# Altium schematic sheet rtm-connectors.SchDoc: MicroTCA RTM Connectors
size A3; DocumentNumber: 2; SheetNumber: 2; SheetTotal: 9
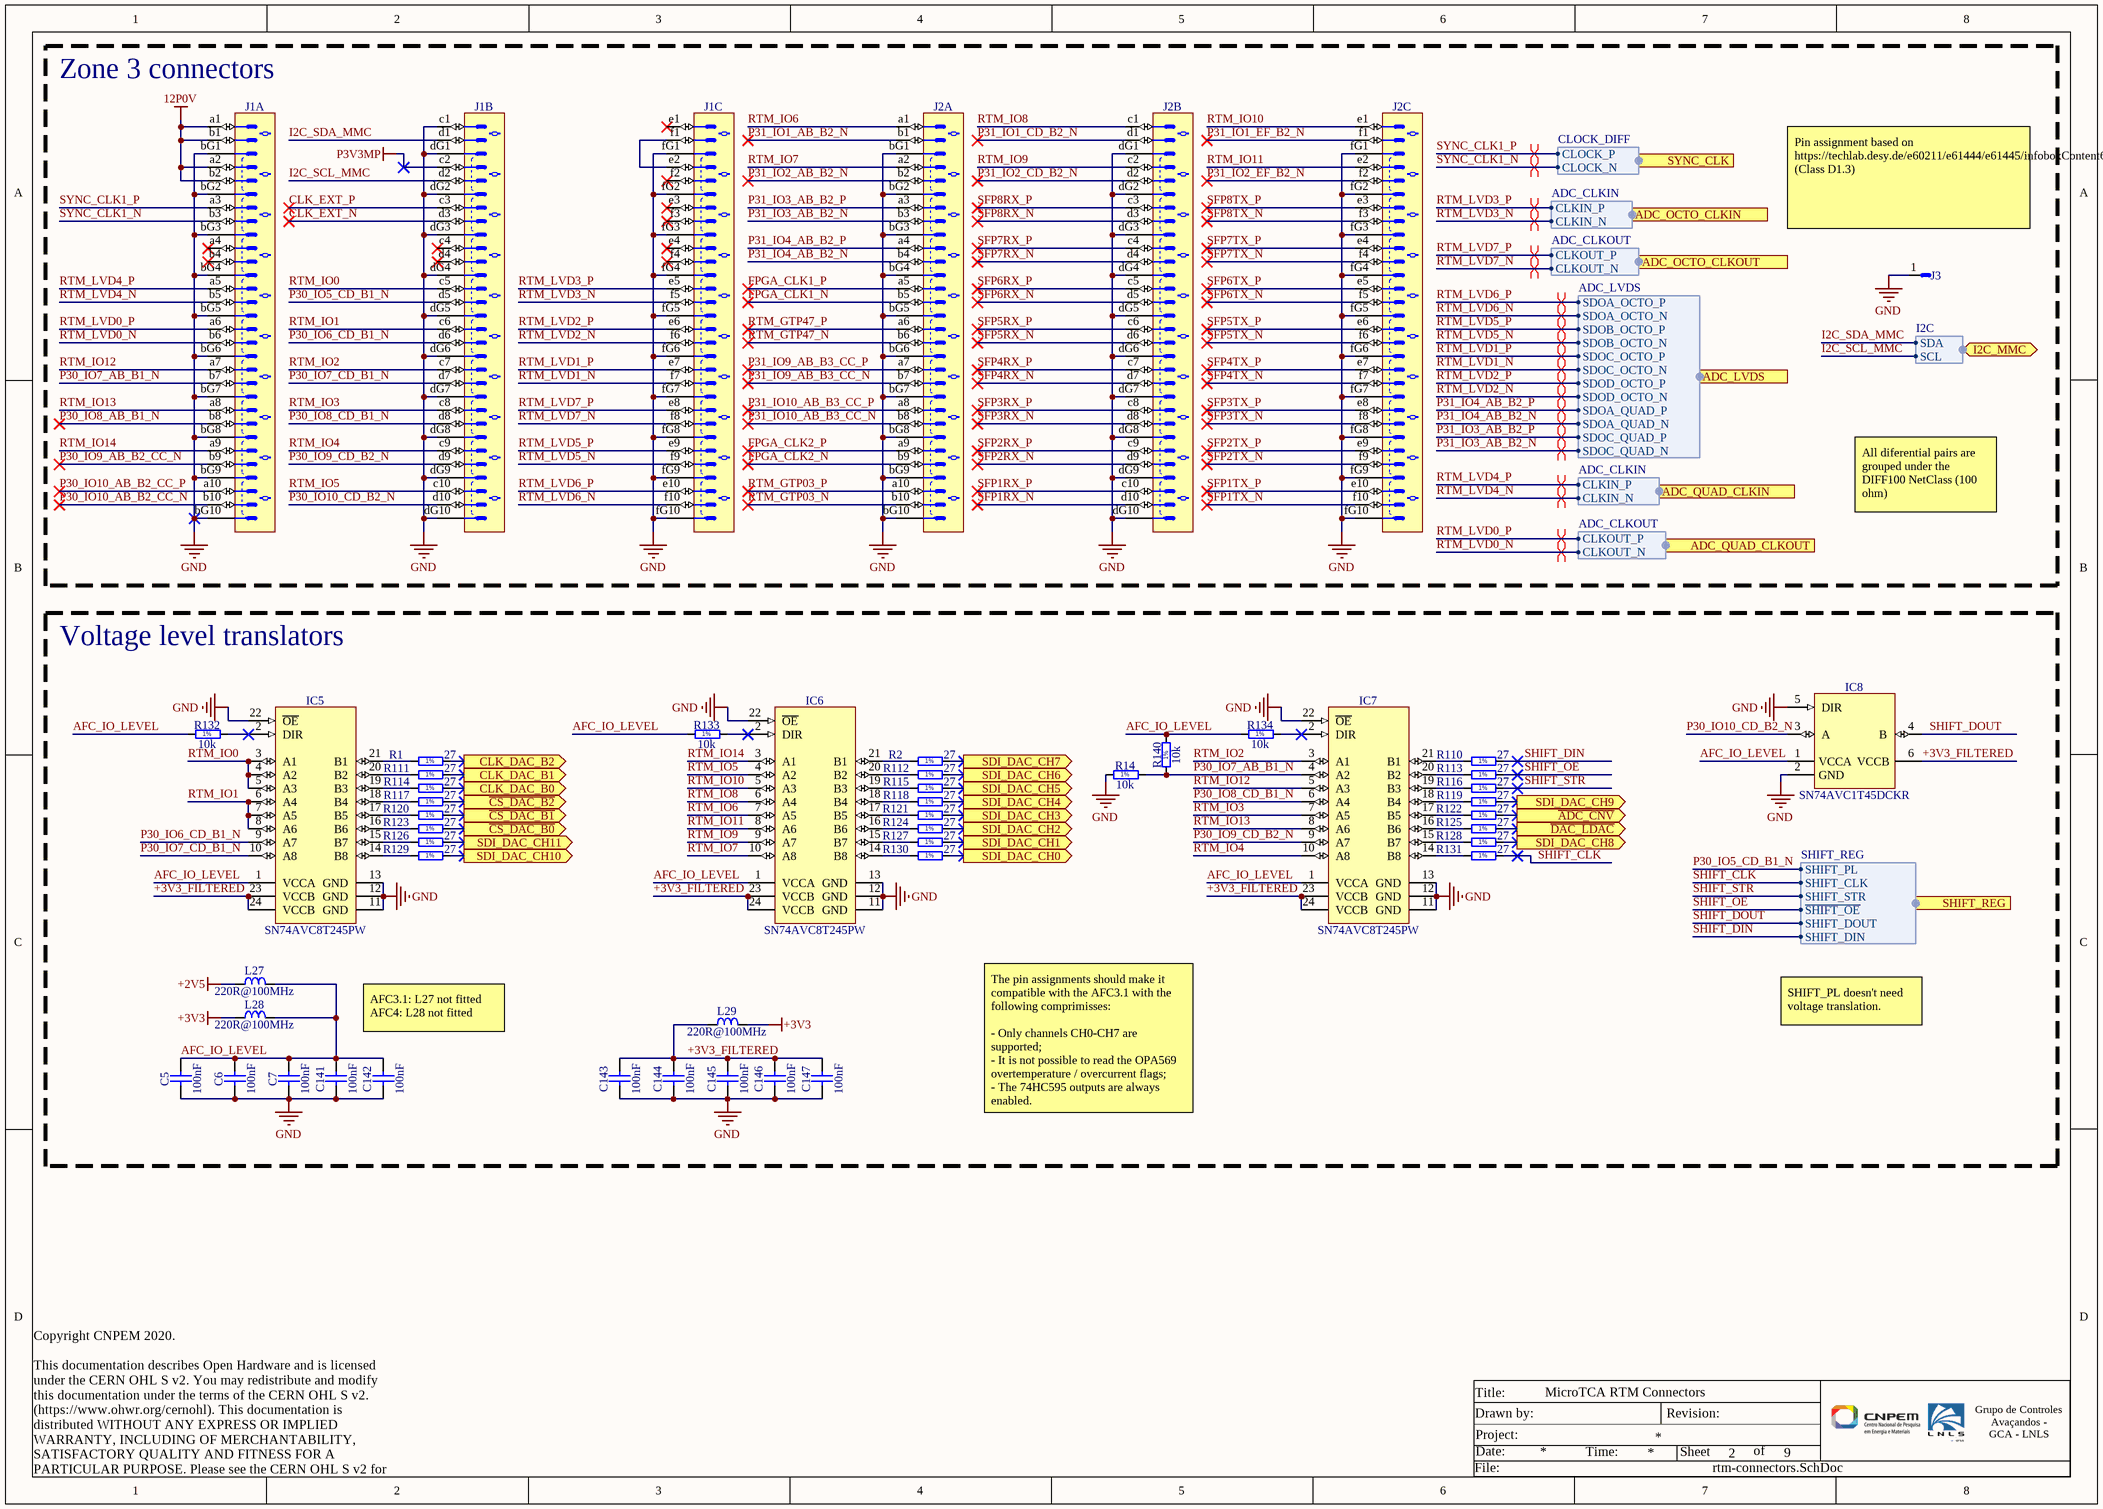
[diagram p0: rtm-connectors.SchDoc]

## Parts
C5  100nF  [CAPC1005X55N]
C6  100nF  [CAPC1005X55N]
C7  100nF  [CAPC1005X55N]
C141  100nF  [CAPC1005X55N]
C142  100nF  [CAPC1005X55N]
C143  100nF  [CAPC1005X55N]
C144  100nF  [CAPC1005X55N]
C145  100nF  [CAPC1005X55N]
C146  100nF  [CAPC1005X55N]
C147  100nF  [CAPC1005X55N]
IC5  SN74AVC8T245PW  [SOP65P640X120-24N]
IC6  SN74AVC8T245PW  [SOP65P640X120-24N]
IC7  SN74AVC8T245PW  [SOP65P640X120-24N]
IC8  SN74AVC1T45DCKR  [SOT65P210X110-6N]
J1  Advanced TCA  [TYCO_6469183-1_0.65mm]  (value not drawn)  (parts A,B,C of 3)
J2  Advanced TCA  [TYCO_6469183-1_0.65mm]  (value not drawn)  (parts A,B,C of 3)
J3  (no value)  [TYCO_1469265-1]
L27  220R@100MHz  [INDC2012X105N]
L28  220R@100MHz  [INDC2012X105N]
L29  220R@100MHz  [INDC2012X105N]
R1  27  [RESC1005X40N]
R2  27  [RESC1005X40N]
R14  10k  [RESC1005X40N]
R110  27  [RESC1005X40N]
R111  27  [RESC1005X40N]
R112  27  [RESC1005X40N]
R113  27  [RESC1005X40N]
R114  27  [RESC1005X40N]
R115  27  [RESC1005X40N]
R116  27  [RESC1005X40N]
R117  27  [RESC1005X40N]
R118  27  [RESC1005X40N]
R119  27  [RESC1005X40N]
R120  27  [RESC1005X40N]
R121  27  [RESC1005X40N]
R122  27  [RESC1005X40N]
R123  27  [RESC1005X40N]
R124  27  [RESC1005X40N]
R125  27  [RESC1005X40N]
R126  27  [RESC1005X40N]
R127  27  [RESC1005X40N]
R128  27  [RESC1005X40N]
R129  27  [RESC1005X40N]
R130  27  [RESC1005X40N]
R131  27  [RESC1005X40N]
R132  10k  [RESC1005X40N]
R133  10k  [RESC1005X40N]
R134  10k  [RESC1005X40N]
R140  10k  [RESC1005X40N]

## Blocks framed on the sheet
Zone 3 connectors: J1-J3
Voltage level translators: C5-C7 C141-C147 IC5-IC8 L27-L29 R1 R2 R14 R110-R134 R140

## Ports
ADC_LVDS (harness ADC_LVDS), ADC_OCTO_CLKIN (harness ADC_CLKIN), ADC_OCTO_CLKOUT (harness ADC_CLKOUT), ADC_QUAD_CLKIN (harness ADC_CLKIN), ADC_QUAD_CLKOUT (harness ADC_CLKOUT), CLK_DAC_B0 (out), CLK_DAC_B1 (out), CLK_DAC_B2 (out), I2C_MMC (bidir, harness I2C), SDI_DAC_CH0 (out), SDI_DAC_CH1 (out), SDI_DAC_CH2 (out), SDI_DAC_CH3 (out), SDI_DAC_CH4 (out), SDI_DAC_CH5 (out), SDI_DAC_CH6 (out), SDI_DAC_CH7 (out), SDI_DAC_CH8 (out), SDI_DAC_CH9 (out), SDI_DAC_CH10 (out), SDI_DAC_CH11 (out), SHIFT_REG (out, harness SHIFT_REG), SYNC_CLK (harness CLOCK_DIFF), ~{ADC_CNV} (out), ~{CS_DAC_B0} (out), ~{CS_DAC_B1} (out), ~{CS_DAC_B2} (out), ~{DAC_LDAC} (out)

## Harnesses
CLOCK_DIFF: CLOCK_P, CLOCK_N
I2C: SDA, SCL
SHIFT_REG: SHIFT_PL, SHIFT_CLK, SHIFT_STR, ~{SHIFT_OE}, SHIFT_DOUT, SHIFT_DIN
ADC_LVDS: SDOA_OCTO_P, SDOA_OCTO_N, SDOB_OCTO_P, SDOB_OCTO_N, SDOC_OCTO_P, SDOC_OCTO_N, SDOD_OCTO_P, SDOD_OCTO_N, SDOA_QUAD_P, SDOA_QUAD_N, SDOC_QUAD_P, SDOC_QUAD_N
ADC_CLKIN: CLKIN_P, CLKIN_N
ADC_CLKOUT: CLKOUT_P, CLKOUT_N

## Nets
12P0V: J1.a1 J1.a2 J1.b1 J1.b2
+2V5: L27.1
+3V3: L28.1 L29.2
GND: C5.1 C6.1 C7.1 C141.1 C142.1 C143.1 C144.1 C145.1 C146.1 C147.1 IC5.11(GND) IC5.12(GND) IC5.13(GND) IC5.22(~{OE}) IC6.11(GND) IC6.12(GND) IC6.13(GND) IC6.22(~{OE}) IC7.11(GND) IC7.12(GND) IC7.13(GND) IC7.22(~{OE}) IC8.2(GND) IC8.5(DIR) J1.bG1 J1.bG2 J1.bG3 J1.bG4 J1.bG5 J1.bG6 J1.bG7 J1.bG8 J1.bG9 J1.bG10 J1.c1 J1.dG1 J1.dG2 J1.dG3 J1.dG4 J1.dG5 J1.dG6 J1.dG7 J1.dG8 J1.dG9 J1.dG10 J1.fG1 J1.fG2 J1.fG3 J1.fG4 J1.fG5 J1.fG6 J1.fG7 J1.fG8 J1.fG9 J1.fG10 J2.bG1 J2.bG2 J2.bG3 J2.bG4 J2.bG5 J2.bG6 J2.bG7 J2.bG8 J2.bG9 J2.bG10 J2.dG1 J2.dG2 J2.dG3 J2.dG4 J2.dG5 J2.dG6 J2.dG7 J2.dG8 J2.dG9 J2.dG10 J2.fG1 J2.fG2 J2.fG3 J2.fG4 J2.fG5 J2.fG6 J2.fG7 J2.fG8 J2.fG9 J2.fG10 J3.1 R14.1
P3V3MP: J1.c2
+3V3_FILTERED: C143.2 C144.2 C145.2 C146.2 C147.2 IC5.23(VCCB) IC5.24(VCCB) IC6.23(VCCB) IC6.24(VCCB) IC7.23(VCCB) IC7.24(VCCB) IC8.6(VCCB) L29.1
~{ADC_CNV}: R122.2 ; port ~{ADC_CNV}
AFC_IO_LEVEL: C5.2 C6.2 C7.2 C141.2 C142.2 IC5.1(VCCA) IC6.1(VCCA) IC7.1(VCCA) IC8.1(VCCA) L27.2 L28.2 R132.1 R133.1 R134.1 R140.2
~{CS_DAC_B0}: R123.2 ; port ~{CS_DAC_B0}
~{CS_DAC_B1}: R120.2 ; port ~{CS_DAC_B1}
~{CS_DAC_B2}: R117.2 ; port ~{CS_DAC_B2}
CLK_DAC_B0: R114.2 ; port CLK_DAC_B0
CLK_DAC_B1: R111.2 ; port CLK_DAC_B1
CLK_DAC_B2: R1.2 ; port CLK_DAC_B2
CLK_EXT_N: J1.d3
CLK_EXT_P: J1.c3
~{DAC_LDAC}: R125.2 ; port ~{DAC_LDAC}
FPGA_CLK1_N: J2.b5
FPGA_CLK1_P: J2.a5
FPGA_CLK2_N: J2.b9
FPGA_CLK2_P: J2.a9
I2C_SCL_MMC: J1.d2 ; port I2C_MMC.SCL
I2C_SDA_MMC: J1.d1 ; port I2C_MMC.SDA
P30_IO5_CD_B1_N: J1.d5 ; port SHIFT_REG.SHIFT_PL
P30_IO6_CD_B1_N: IC5.9(A7) J1.d6
P30_IO7_AB_B1_N: IC7.4(A2) J1.b7 R14.2 R140.1
P30_IO7_CD_B1_N: IC5.10(A8) J1.d7
P30_IO8_AB_B1_N: J1.b8
P30_IO8_CD_B1_N: IC7.6(A4) J1.d8
P30_IO9_AB_B2_CC_N: J1.b9
P30_IO9_CD_B2_N: IC7.9(A7) J1.d9
P30_IO10_AB_B2_CC_N: J1.b10
P30_IO10_AB_B2_CC_P: J1.a10
P30_IO10_CD_B2_N: IC8.3(A) J1.d10
P31_IO1_AB_B2_N: J2.b1
P31_IO1_CD_B2_N: J2.d1
P31_IO1_EF_B2_N: J2.f1
P31_IO2_AB_B2_N: J2.b2
P31_IO2_CD_B2_N: J2.d2
P31_IO2_EF_B2_N: J2.f2
P31_IO3_AB_B2_N: J2.b3 ; port ADC_LVDS.SDOC_QUAD_N
P31_IO3_AB_B2_P: J2.a3 ; port ADC_LVDS.SDOC_QUAD_P
P31_IO4_AB_B2_N: J2.b4 ; port ADC_LVDS.SDOA_QUAD_N
P31_IO4_AB_B2_P: J2.a4 ; port ADC_LVDS.SDOA_QUAD_P
P31_IO9_AB_B3_CC_N: J2.b7
P31_IO9_AB_B3_CC_P: J2.a7
P31_IO10_AB_B3_CC_N: J2.b8
P31_IO10_AB_B3_CC_P: J2.a8
RTM_GTP03_N: J2.b10
RTM_GTP03_P: J2.a10
RTM_GTP47_N: J2.b6
RTM_GTP47_P: J2.a6
RTM_IO0: IC5.3(A1) IC5.4(A2) IC5.5(A3) J1.c5
RTM_IO1: IC5.6(A4) IC5.7(A5) IC5.8(A6) J1.c6
RTM_IO2: IC7.3(A1) J1.c7
RTM_IO3: IC7.7(A5) J1.c8
RTM_IO4: IC7.10(A8) J1.c9
RTM_IO5: IC6.4(A2) J1.c10
RTM_IO6: IC6.7(A5) J2.a1
RTM_IO7: IC6.10(A8) J2.a2
RTM_IO8: IC6.6(A4) J2.c1
RTM_IO9: IC6.9(A7) J2.c2
RTM_IO10: IC6.5(A3) J2.e1
RTM_IO11: IC6.8(A6) J2.e2
RTM_IO12: IC7.5(A3) J1.a7
RTM_IO13: IC7.8(A6) J1.a8
RTM_IO14: IC6.3(A1) J1.a9
RTM_LVD0_N: J1.b6 ; port ADC_QUAD_CLKOUT.CLKOUT_N
RTM_LVD0_P: J1.a6 ; port ADC_QUAD_CLKOUT.CLKOUT_P
RTM_LVD1_N: J1.f7 ; port ADC_LVDS.SDOC_OCTO_N
RTM_LVD1_P: J1.e7 ; port ADC_LVDS.SDOC_OCTO_P
RTM_LVD2_N: J1.f6 ; port ADC_LVDS.SDOD_OCTO_N
RTM_LVD2_P: J1.e6 ; port ADC_LVDS.SDOD_OCTO_P
RTM_LVD3_N: J1.f5 ; port ADC_OCTO_CLKIN.CLKIN_N
RTM_LVD3_P: J1.e5 ; port ADC_OCTO_CLKIN.CLKIN_P
RTM_LVD4_N: J1.b5 ; port ADC_QUAD_CLKIN.CLKIN_N
RTM_LVD4_P: J1.a5 ; port ADC_QUAD_CLKIN.CLKIN_P
RTM_LVD5_N: J1.f9 ; port ADC_LVDS.SDOB_OCTO_N
RTM_LVD5_P: J1.e9 ; port ADC_LVDS.SDOB_OCTO_P
RTM_LVD6_N: J1.f10 ; port ADC_LVDS.SDOA_OCTO_N
RTM_LVD6_P: J1.e10 ; port ADC_LVDS.SDOA_OCTO_P
RTM_LVD7_N: J1.f8 ; port ADC_OCTO_CLKOUT.CLKOUT_N
RTM_LVD7_P: J1.e8 ; port ADC_OCTO_CLKOUT.CLKOUT_P
~{SHIFT_OE}: R113.2 ; port SHIFT_REG.~{SHIFT_OE}
SDI_DAC_CH0: R130.2 ; port SDI_DAC_CH0
SDI_DAC_CH1: R127.2 ; port SDI_DAC_CH1
SDI_DAC_CH2: R124.2 ; port SDI_DAC_CH2
SDI_DAC_CH3: R121.2 ; port SDI_DAC_CH3
SDI_DAC_CH4: R118.2 ; port SDI_DAC_CH4
SDI_DAC_CH5: R115.2 ; port SDI_DAC_CH5
SDI_DAC_CH6: R112.2 ; port SDI_DAC_CH6
SDI_DAC_CH7: R2.2 ; port SDI_DAC_CH7
SDI_DAC_CH8: R128.2 ; port SDI_DAC_CH8
SDI_DAC_CH9: R119.2 ; port SDI_DAC_CH9
SDI_DAC_CH10: R129.2 ; port SDI_DAC_CH10
SDI_DAC_CH11: R126.2 ; port SDI_DAC_CH11
SFP1RX_N: J2.d10
SFP1RX_P: J2.c10
SFP1TX_N: J2.f10
SFP1TX_P: J2.e10
SFP2RX_N: J2.d9
SFP2RX_P: J2.c9
SFP2TX_N: J2.f9
SFP2TX_P: J2.e9
SFP3RX_N: J2.d8
SFP3RX_P: J2.c8
SFP3TX_N: J2.f8
SFP3TX_P: J2.e8
SFP4RX_N: J2.d7
SFP4RX_P: J2.c7
SFP4TX_N: J2.f7
SFP4TX_P: J2.e7
SFP5RX_N: J2.d6
SFP5RX_P: J2.c6
SFP5TX_N: J2.f6
SFP5TX_P: J2.e6
SFP6RX_N: J2.d5
SFP6RX_P: J2.c5
SFP6TX_N: J2.f5
SFP6TX_P: J2.e5
SFP7RX_N: J2.d4
SFP7RX_P: J2.c4
SFP7TX_N: J2.f4
SFP7TX_P: J2.e4
SFP8RX_N: J2.d3
SFP8RX_P: J2.c3
SFP8TX_N: J2.f3
SFP8TX_P: J2.e3
SHIFT_CLK: R131.2 ; port SHIFT_REG.SHIFT_CLK
SHIFT_DIN: R110.2 ; port SHIFT_REG.SHIFT_DIN
SHIFT_DOUT: IC8.4(B) ; port SHIFT_REG.SHIFT_DOUT
SHIFT_STR: R116.2 ; port SHIFT_REG.SHIFT_STR
SYNC_CLK1_N: J1.b3 ; port SYNC_CLK.CLOCK_N
SYNC_CLK1_P: J1.a3 ; port SYNC_CLK.CLOCK_P
NetIC5_2: IC5.2(DIR) R132.2
NetIC5_14: IC5.14(B8) R129.1
NetIC5_15: IC5.15(B7) R126.1
NetIC5_16: IC5.16(B6) R123.1
NetIC5_17: IC5.17(B5) R120.1
NetIC5_18: IC5.18(B4) R117.1
NetIC5_19: IC5.19(B3) R114.1
NetIC5_20: IC5.20(B2) R111.1
NetIC5_21: IC5.21(B1) R1.1
NetIC6_2: IC6.2(DIR) R133.2
NetIC6_14: IC6.14(B8) R130.1
NetIC6_15: IC6.15(B7) R127.1
NetIC6_16: IC6.16(B6) R124.1
NetIC6_17: IC6.17(B5) R121.1
NetIC6_18: IC6.18(B4) R118.1
NetIC6_19: IC6.19(B3) R115.1
NetIC6_20: IC6.20(B2) R112.1
NetIC6_21: IC6.21(B1) R2.1
NetIC7_2: IC7.2(DIR) R134.2
NetIC7_14: IC7.14(B8) R131.1
NetIC7_15: IC7.15(B7) R128.1
NetIC7_16: IC7.16(B6) R125.1
NetIC7_17: IC7.17(B5) R122.1
NetIC7_18: IC7.18(B4) R119.1
NetIC7_19: IC7.19(B3) R116.1
NetIC7_20: IC7.20(B2) R113.1
NetIC7_21: IC7.21(B1) R110.1
NetJ1_e2: J1.e2 J1.f1

Not connected (* = marked no-connect by the designer): J1 a4* b4* c4* d4* e1* e3* e4* f2* f3* f4*

## Layout directives
differential pair; differential pair class DIFF100: P31_IO3_AB_B2_N, P31_IO3_AB_B2_P, P31_IO4_AB_B2_N, P31_IO4_AB_B2_P, RTM_LVD0_N, RTM_LVD0_P, RTM_LVD1_N, RTM_LVD1_P, RTM_LVD2_N, RTM_LVD2_P, RTM_LVD3_N, RTM_LVD3_P, RTM_LVD4_N, RTM_LVD4_P, RTM_LVD5_N, RTM_LVD5_P, RTM_LVD6_N, RTM_LVD6_P, RTM_LVD7_N, RTM_LVD7_P, SYNC_CLK1_N, SYNC_CLK1_P

## Notes on the sheet
- (near J3) Pin assignment based on https://techlab.desy.de/e60211/e61444/e61445/infoboxContent65133/ZONE_3_Classification_Recomendation_Class_D1.0-4_RevA.3_eng.pdf
  (Class D1.3)
- All diferential pairs are grouped under the DIFF100 NetClass (100 ohm)
- AFC3.1: L27 not fitted
  AFC4: L28 not fitted
- SHIFT_PL doesn't need voltage translation.
- The pin assignments should make it compatible with the AFC3.1 with the following comprimisses:
  - Only channels CH0-CH7 are supported;
  - It is not possible to read the OPA569 overtemperature / overcurrent flags;
  - The 74HC595 outputs are always enabled.
- Title:
- Date:
- Project:
- Drawn by:
- Time:
- Revision:
- Sheet
- of
- Grupo de Controles Avaçandos -
  GCA - LNLS
- Copyright CNPEM 2020.
  This documentation describes Open Hardware and is licensed under the CERN OHL S v2. You may redistribute and modify this documentation under the terms of the CERN OHL S v2. (https://www.ohwr.org/cernohl). This documentation is distributed WITHOUT ANY EXPRESS OR IMPLIED WARRANTY, INCLUDING OF MERCHANTABILITY, SATISFACTORY QUALITY AND FITNESS FOR A PARTICULAR PURPOSE. Please see the CERN OHL S v2 for applicable conditions.
- File:
- (in symbol R0402_10K_1%_0.0625W_100PPM) 1%
- (in symbol R0402_27R_1%_0.0625W_100PPM) 1%

## Library data of the parts
C5-C7 C141-C147 = CC0402_100NF_16V_10%_X7R: SMD Multilayer Chip Ceramic Capacitor; Manufacturer: GENERIC; Manufacturer1 Part Number: GRM155R71C104KA88D; Voltage: 16V; TC: X7R; Tolerance: ±10%; Part Number: CC0402_100NF_16V_10%_X7R; Component Kind: Standard; Component Type: Standard; Pin Count: 2; Value: 100nF; Status: Not Recommended; Manufacturer Part Number: CC0402_100NF_16V_10%_X7R; Case: 0402; Mounted: Yes; Socket: No; SMD: Yes; Sense: No; Manufacturer1 Example: MURATA; Manufacturer1 ComponentHeight: 0.55mm; HelpURL: \\cern.ch\dfs\Applications\Altium\Datasheets\CC0402_X7R_MURATA_GRM.pdf; Author: CERN DEM JLC; CreateDate: 05/12/2013; LatestRevisionDate: 03/12/2007
IC5-IC7 = SN74AVC8T245PW: 8-Bit Dual-Supply Bus Transceiver With Configurable Voltage Translation and 3-State Outputs; Manufacturer: TEXAS INSTRUMENTS; PressFit: No; Bonding: No; Part Number: SN74AVC8T245PW; Component Kind: Standard; Component Type: Standard; Device: SN74AVC8T245PW; PackageDescription: SOP, 0.65mm Pitch; 24 Pin, 4.40mm W X 7.80mm L X 1.20mm H Body, IPC Medium Density; Manufacturer Part Number: SN74AVC8T245PW; Pin Count: 24; Case: TSSOP24; Mounted: Yes; Socket: No; SMD: Yes; Sense: No; ComponentHeight: 1.2mm; Author: CERN DEM JLC; HelpURL: \\cern.ch\dfs\Applications\Altium\Datasheets\SN74AVC8T245PW.pdf; CreateDate: 07/03/2012; LatestRevisionDate: 07/03/2012
IC8 = SN74AVC1T45DCKR: Single-Bit Dual-Supply Bus Transceiver with Configurable Voltage Translation and 3-State Outputs; Manufacturer: TEXAS INSTRUMENTS; PressFit: No; Bonding: No; Part Number: SN74AVC1T45DCKR; Component Kind: Standard; Component Type: Standard; Device: SN74AVC1T45DCKR; PackageDescription: SOT363, SC70-6, SOT, 0.65mm Pitch, 6 pin, 1.25mm W X 2.00mm L X 1.10mm H, IPC Medium Density; Manufacturer Part Number: SN74AVC1T45DCKR; Pin Count: 6; Case: SOT363; Mounted: Yes; Socket: No; SMD: Yes; Sense: No; ComponentHeight: 1.1mm; Author: CERN DEM JLC; HelpURL: \\cern.ch\dfs\Applications\Altium\Datasheets\SN74AVC1T45DCKR.pdf; CreateDate: 07/07/2014; LatestRevisionDate: 07/07/2014
J1 J2 = TYCO_6469183-1_0.65mm: 60 Positions, Pitch 2.5mm,  Advanced TCA, Z-PACK HM-Zd Right Angle Press Fit Header (0.65mm holes); Manufacturer: TYCO ELECTRONICS; Part Number: TYCO_6469183-1_0.65mm; Component Kind: Standard; Component Type: Standard; Pin Count: 90; Family: Advanced TCA; Mounted: Yes; Socket: No; SMD: No; PressFit: Yes; Sense: No; Status: None; Manufacturer Part Number: 6469183-1; ComponentHeight: 13.31mm; HelpURL: \\cern.ch\dfs\Applications\Altium\Datasheets\TYCO_6469183-1.pdf; Author: LNLS GCA AFG; CreateDate: 03/09/2021; LatestRevisionDate: 03/09/2021
J3 = TYCO_1469265-1: Universal Right Angle Male Power Module Guide (keyed); Manufacturer: TYCO ELECTRONICS; PressFit: No; Part Number: TYCO_1469265-1; Component Kind: Standard; Component Type: Standard; Pin Count: 1; Mounted: Yes; Socket: No; SMD: No; Sense: No; Status: None; Manufacturer Part Number: 1469265-1; ComponentHeight: 9.78mm; HelpURL: \\cern.ch\dfs\Applications\Altium\Datasheets\TYCO_1469265-1.pdf; Author: CERN DEM JLC; CreateDate: 28/08/2013; LatestRevisionDate: 28/08/2013
L27-L29 = IND0805_MURATA_BLM21PG221SN1D: SMD EMIFIL Suppression Chip Ferrite Bead; Manufacturer: MURATA; Power: 2A; Resistance: 0.05R; Tolerance: ±25%; Part Number: IND0805_MURATA_BLM21PG221SN1D; Component Kind: Standard; Component Type: Standard; Pin Count: 2; Value: 220R@100MHz; Status: None; Manufacturer Part Number: BLM21PG221SN1D; Case: 0805; Mounted: Yes; Socket: No; SMD: Yes; Sense: No; ComponentHeight: 1.05mm; HelpURL: \\cern.ch\dfs\Applications\Altium\Datasheets\IND0402_MURATA_BLM21P.pdf; Author: CERN DEM JLC; CreateDate: 25/01/2010; LatestRevisionDate: 25/01/2010
R1 R2 R110-R131 = R0402_27R_1%_0.0625W_100PPM: General Purpose Thick Film Chip Resistor; Manufacturer: GENERIC; Manufacturer1 Part Number: 232270672709L; TC: ±100ppm/°C; Tolerance: ±1%; Part Number: R0402_27R_1%_0.0625W_100PPM; Component Kind: Standard; Component Type: Standard; Pin Count: 2; Value: 27; Status: Not recommended; Power: 0.0625W; Manufacturer Part Number: R0402_27R_1%_0.0625W_100PPM; Case: 0402; Mounted: Yes; Sense: No; Socket: No; SMD: Yes; Manufacturer1 Example: YAGEO PHYCOMP; Manufacturer1 ComponentHeight: 0.4mm; HelpURL: \\cern.ch\dfs\Applications\Altium\Datasheets\R0402_Phycomp_RC0402.pdf; Author: CERN DEM JLC; CreateDate: 03/12/2007; LatestRevisionDate: 17/10/2012
R14 R132-R134 R140 = R0402_10K_1%_0.0625W_100PPM: General Purpose Thick Film Chip Resistor; Manufacturer: GENERIC; Manufacturer1 Part Number: 232270671003L; TC: ±100ppm/°C; Tolerance: ±1%; Part Number: R0402_10K_1%_0.0625W_100PPM; Component Kind: Standard; Component Type: Standard; Pin Count: 2; Value: 10k; Status: Not recommended; Power: 0.0625W; Manufacturer Part Number: R0402_10K_1%_0.0625W_100PPM; Case: 0402; Mounted: Yes; Sense: No; Socket: No; SMD: Yes; Manufacturer1 Example: YAGEO PHYCOMP; Manufacturer1 ComponentHeight: 0.4mm; HelpURL: \\cern.ch\dfs\Applications\Altium\Datasheets\R0402_Phycomp_RC0402.pdf; Author: CERN DEM JLC; CreateDate: 03/12/2007; LatestRevisionDate: 17/10/2012